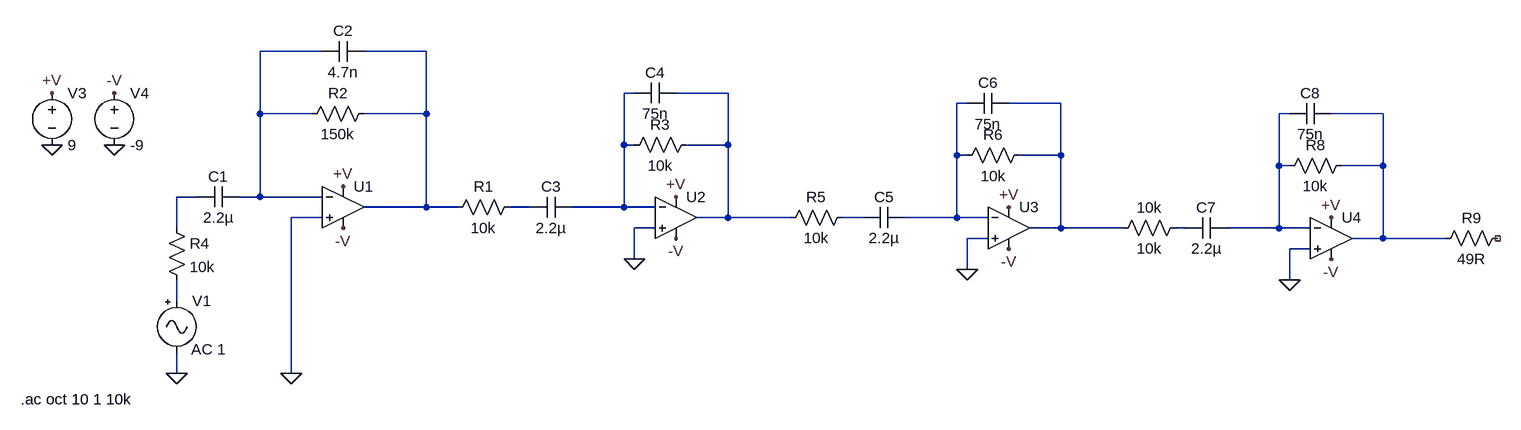
[diagram p0: schematic AnalogFilterV2.asc]
AnalogFilterV2.asc, the LTspice schematic file:
Version 4
SHEET 1 2280 680
WIRE 464 -272 368 -272
WIRE 624 -272 528 -272
WIRE 944 -208 928 -208
WIRE 1088 -208 1008 -208
WIRE 1456 -192 1440 -192
WIRE 1600 -192 1520 -192
WIRE 368 -176 368 -272
WIRE 448 -176 368 -176
WIRE 624 -176 624 -272
WIRE 624 -176 528 -176
WIRE 1952 -176 1936 -176
WIRE 2096 -176 2016 -176
WIRE 928 -128 928 -208
WIRE 944 -128 928 -128
WIRE 1088 -128 1088 -208
WIRE 1088 -128 1024 -128
WIRE 1440 -112 1440 -192
WIRE 1456 -112 1440 -112
WIRE 1600 -112 1600 -192
WIRE 1600 -112 1536 -112
WIRE 1936 -96 1936 -176
WIRE 1952 -96 1936 -96
WIRE 2096 -96 2096 -176
WIRE 2096 -96 2032 -96
WIRE 272 -48 240 -48
WIRE 368 -48 368 -176
WIRE 368 -48 336 -48
WIRE 464 -48 368 -48
WIRE 624 -32 624 -176
WIRE 624 -32 528 -32
WIRE 672 -32 624 -32
WIRE 784 -32 752 -32
WIRE 928 -32 928 -128
WIRE 928 -32 848 -32
WIRE 976 -32 928 -32
WIRE 464 -16 416 -16
WIRE 1088 -16 1088 -128
WIRE 1088 -16 1040 -16
WIRE 1184 -16 1088 -16
WIRE 1296 -16 1264 -16
WIRE 1440 -16 1440 -112
WIRE 1440 -16 1360 -16
WIRE 1488 -16 1440 -16
WIRE 240 0 240 -48
WIRE 976 0 944 0
WIRE 1600 0 1600 -112
WIRE 1600 0 1552 0
WIRE 1696 0 1600 0
WIRE 1792 0 1776 0
WIRE 1936 0 1936 -96
WIRE 1936 0 1856 0
WIRE 1984 0 1936 0
WIRE 1488 16 1456 16
WIRE 2096 16 2096 -96
WIRE 2096 16 2048 16
WIRE 2192 16 2096 16
WIRE 1984 32 1952 32
WIRE 944 48 944 0
WIRE 1456 64 1456 16
WIRE 1952 80 1952 32
WIRE 240 112 240 80
WIRE 240 224 240 192
WIRE 416 224 416 -16
FLAG 240 224 0
FLAG 416 224 0
FLAG 496 -64 +V
FLAG 496 0 -V
FLAG 48 -128 0
FLAG 144 -128 0
FLAG 48 -208 +V
FLAG 144 -208 -V
FLAG 944 48 0
FLAG 1008 16 -V
FLAG 1008 -48 +V
FLAG 1456 64 0
FLAG 1520 32 -V
FLAG 1520 -32 +V
FLAG 1952 80 0
FLAG 2016 48 -V
FLAG 2016 -16 +V
SYMBOL Misc\\signal 240 96 R0
WINDOW 3 37 58 Left 2
WINDOW 123 22 91 Left 2
WINDOW 39 0 0 Left 0
SYMATTR Value ""
SYMATTR Value2 AC 1
SYMATTR InstName V1
SYMBOL cap 272 -32 R270
WINDOW 0 32 32 VTop 2
WINDOW 3 0 32 VBottom 2
SYMATTR InstName C1
SYMATTR Value 2.2µ
SYMBOL OpAmps\\UniversalOpAmp 496 -32 R0
SYMATTR InstName U1
SYMBOL res 432 -160 R270
WINDOW 0 32 56 VTop 2
WINDOW 3 0 56 VBottom 2
SYMATTR InstName R2
SYMATTR Value 150k
SYMBOL voltage 48 -224 R0
WINDOW 123 0 0 Left 0
WINDOW 39 0 0 Left 0
SYMATTR InstName V3
SYMATTR Value 9
SYMBOL voltage 144 -224 R0
WINDOW 123 0 0 Left 0
WINDOW 39 0 0 Left 0
SYMATTR InstName V4
SYMATTR Value -9
SYMBOL res 224 -16 R0
SYMATTR InstName R4
SYMATTR Value 10k
SYMBOL cap 528 -288 R90
WINDOW 0 0 32 VBottom 2
WINDOW 3 32 32 VTop 2
SYMATTR InstName C2
SYMATTR Value 4.7n
SYMBOL res 768 -48 R90
WINDOW 0 0 56 VBottom 2
WINDOW 3 32 56 VTop 2
SYMATTR InstName R1
SYMATTR Value 10k
SYMBOL cap 848 -48 R90
WINDOW 0 0 32 VBottom 2
WINDOW 3 32 32 VTop 2
SYMATTR InstName C3
SYMATTR Value 2.2µ
SYMBOL res 1040 -144 R90
WINDOW 0 0 56 VBottom 2
WINDOW 3 32 56 VTop 2
SYMATTR InstName R3
SYMATTR Value 10k
SYMBOL cap 1008 -224 R90
WINDOW 0 0 32 VBottom 2
WINDOW 3 32 32 VTop 2
SYMATTR InstName C4
SYMATTR Value 75n
SYMBOL OpAmps\\UniversalOpAmp 1008 -16 R0
SYMATTR InstName U2
SYMBOL res 1280 -32 R90
WINDOW 0 0 56 VBottom 2
WINDOW 3 32 56 VTop 2
SYMATTR InstName R5
SYMATTR Value 10k
SYMBOL cap 1360 -32 R90
WINDOW 0 0 32 VBottom 2
WINDOW 3 32 32 VTop 2
SYMATTR InstName C5
SYMATTR Value 2.2µ
SYMBOL res 1552 -128 R90
WINDOW 0 0 56 VBottom 2
WINDOW 3 32 56 VTop 2
SYMATTR InstName R6
SYMATTR Value 10k
SYMBOL cap 1520 -208 R90
WINDOW 0 0 32 VBottom 2
WINDOW 3 32 32 VTop 2
SYMATTR InstName C6
SYMATTR Value 75n
SYMBOL OpAmps\\UniversalOpAmp 1520 0 R0
SYMATTR InstName U3
SYMBOL res 1792 -16 R90
WINDOW 0 0 56 VBottom 2
WINDOW 3 32 56 VTop 2
SYMATTR InstName 10k
SYMATTR Value 10k
SYMBOL cap 1856 -16 R90
WINDOW 0 0 32 VBottom 2
WINDOW 3 32 32 VTop 2
SYMATTR InstName C7
SYMATTR Value 2.2µ
SYMBOL res 2048 -112 R90
WINDOW 0 0 56 VBottom 2
WINDOW 3 32 56 VTop 2
SYMATTR InstName R8
SYMATTR Value 10k
SYMBOL cap 2016 -192 R90
WINDOW 0 0 32 VBottom 2
WINDOW 3 32 32 VTop 2
SYMATTR InstName C8
SYMATTR Value 75n
SYMBOL OpAmps\\UniversalOpAmp 2016 16 R0
SYMATTR InstName U4
SYMBOL res 2288 0 R90
WINDOW 0 0 56 VBottom 2
WINDOW 3 32 56 VTop 2
SYMATTR InstName R9
SYMATTR Value 49R
TEXT 0 264 Left 2 !.ac oct 10 1 10k

The netlist it stands for:
* AnalogFilterV2.asc
V1 N013 0 AC 1
C1 N009 N001 2.2µ
XU1 0 N001 +V -V N002 level1 Avol=1Meg GBW=10Meg Vos=0 En=0 Enk=0 In=0 Ink=0 Rin=500Meg  ; pins In+ In- V+ V- OUT
R2 N001 N002 150k
V3 +V 0 9
V4 -V 0 -9
R4 N009 N013 10k
C2 N002 N001 4.7n
R1 N010 N002 10k
C3 N003 N010 2.2µ
R3 N004 N003 10k
C4 N004 N003 75n
XU2 0 N003 +V -V N004 level1 Avol=1Meg GBW=10Meg Vos=0 En=0 Enk=0 In=0 Ink=0 Rin=500Meg  ; pins In+ In- V+ V- OUT
R5 N011 N004 10k
C5 N005 N011 2.2µ
R6 N006 N005 10k
C6 N006 N005 75n
XU3 0 N005 +V -V N006 level1 Avol=1Meg GBW=10Meg Vos=0 En=0 Enk=0 In=0 Ink=0 Rin=500Meg  ; pins In+ In- V+ V- OUT
R§10k N012 N006 10k
C7 N007 N012 2.2µ
R8 N008 N007 10k
C8 N008 N007 75n
XU4 0 N007 +V -V N008 level1 Avol=1Meg GBW=10Meg Vos=0 En=0 Enk=0 In=0 Ink=0 Rin=500Meg  ; pins In+ In- V+ V- OUT
R9 NC_01 N008 49R
.ac oct 10 1 10k
.lib UniversalOpAmp1.lib
.backanno
.end